# EAGLE board Sparki_Rev15 (EAGLE 6.4)
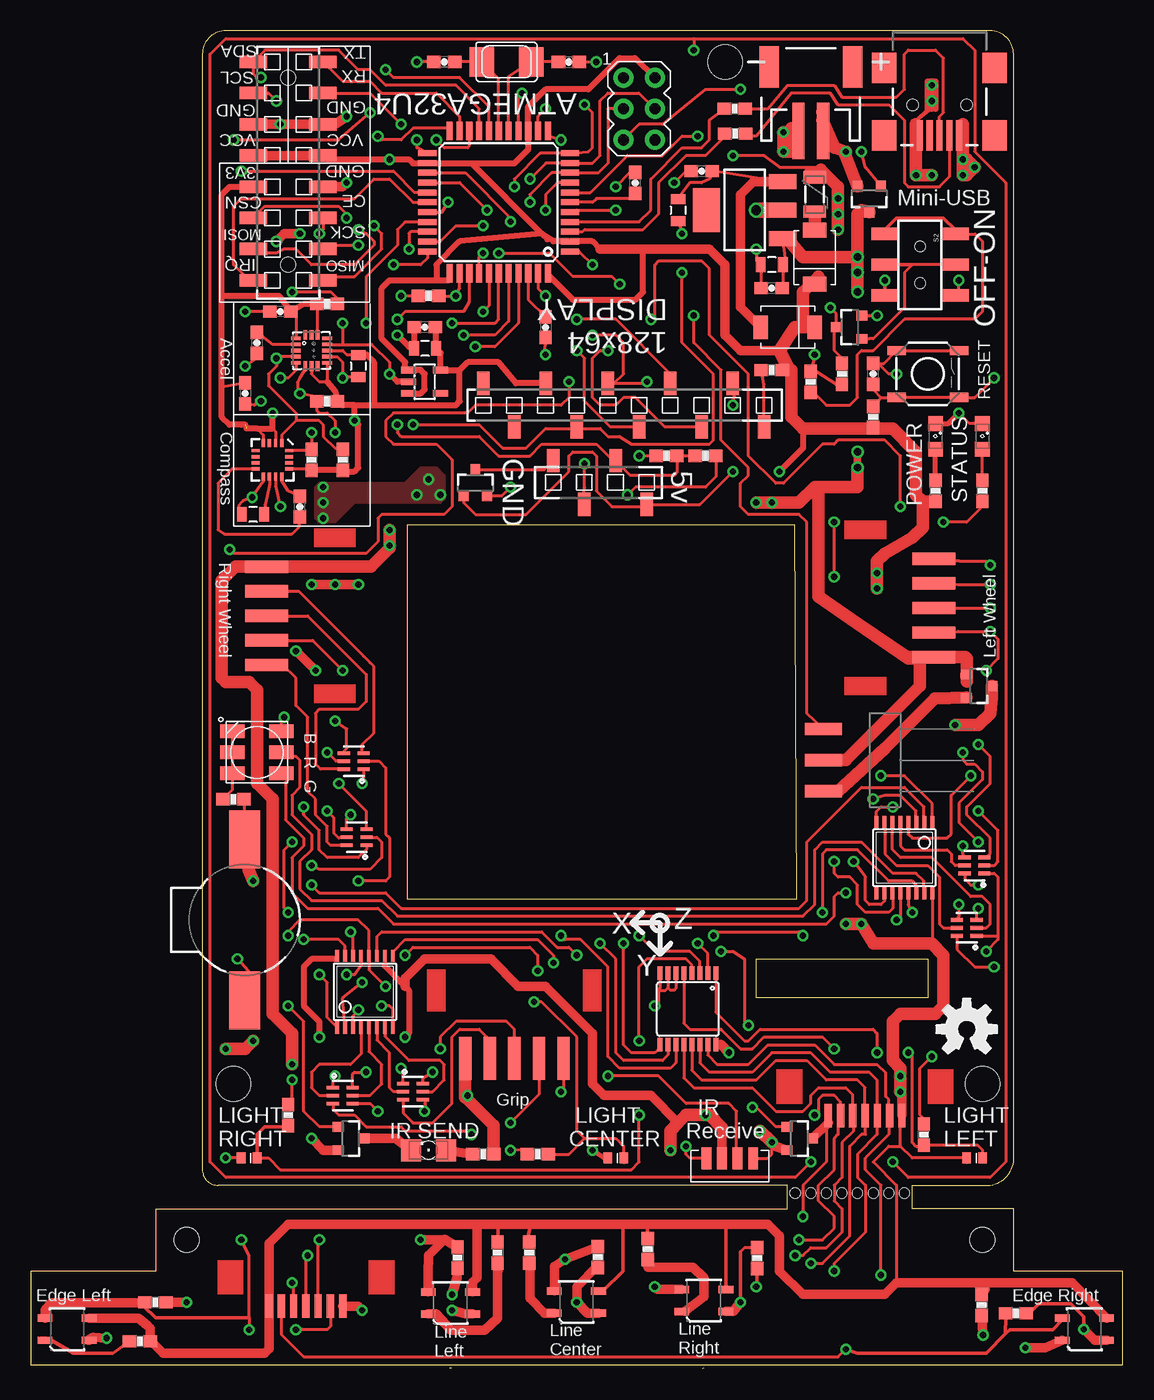
[diagram p2: board, top side]
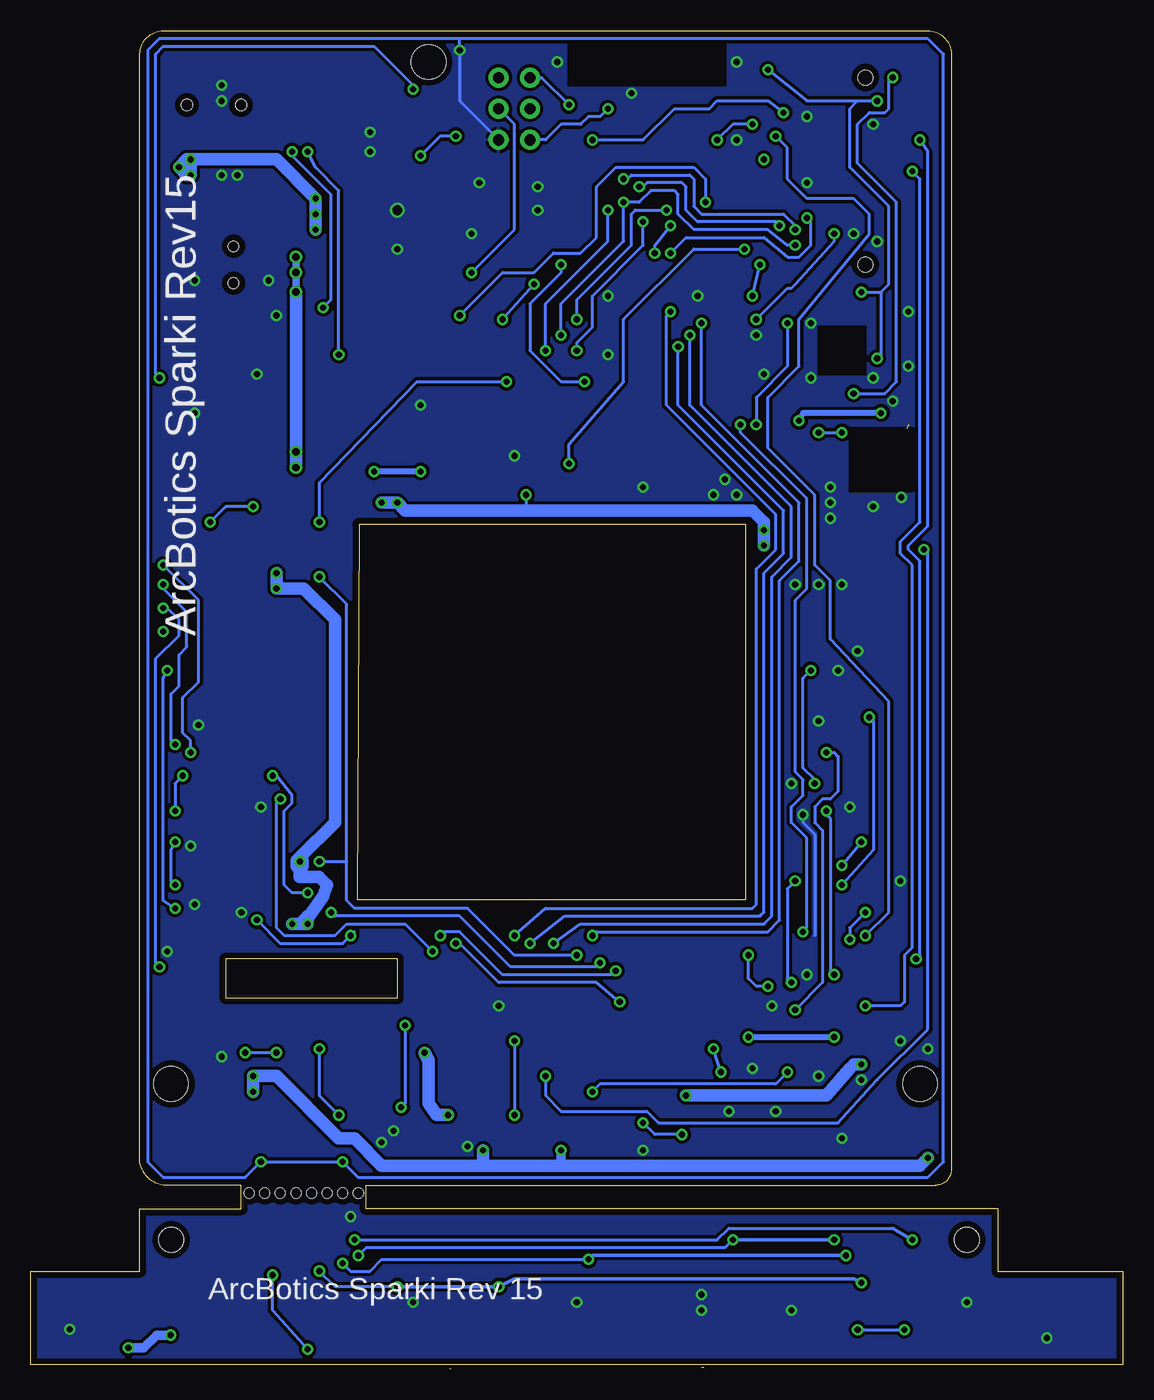
[diagram p3: board, bottom side, seen from below]

Size 88.9 x 108.92 mm. Coordinates in mm from the lower left corner, seen from the top.
Outline: 77.37,14.94 78.11,14.94 arc74 80.01,16.84 80.01,107.01 arc89 78.11,108.92 15.88,108.92 arc90 13.97,107.01 13.97,16.21 arc90 15.24,14.94 61.59,14.94 61.59,13.03 10.16,13.03 10.16,7.95 0,7.95 0,0.33 88.9,0.33 88.9,7.95 80.01,7.95 80.01,13.03 71.75,13.03 71.75,14.94 77.47,14.94
Outline: 34.11,0.1 34.24,0.08
Outline: 54.79,0.05 54.69,0
Outline: 30.66,68.74 62.18,68.74 62.31,38.21 30.66,38.21 30.66,68.74
Outline: 59.05,33.35 73.03,33.35 73.03,30.18 59.05,30.18 59.05,33.35
Copper layers (1+16): Top 0.0178mm / dielectric 59mil / Bottom 0.0178mm
Design rules "China *": minimum track width 10mil, minimum drill 14mil, track to track 10mil, track to pad 10mil, pad to pad 10mil, via to via 10mil, smd to smd 6mil, copper to edge 20mil, drill to drill 16mil, minimum pad ring 8mil, minimum via ring 8mil, stop-mask expansion 3mil, vias tented up to drill 25mil, thermal gap 10mil
Holes 2.79 mm at 56.52,106.38 16.51,23.19 77.47,23.19
Holes 2 mm at 12.7,10.49 77.47,10.49
Holes 0.8 mm at 62.23,14.3 71.12,14.3 69.85,14.3 68.58,14.3 67.31,14.3 66.04,14.3 64.77,14.3 63.5,14.3

## Footprints (pad centres in the part's own frame; a part is rotated, then mirrored left to right if it is on the bottom)
BUZZER-CCV = smd 4.724 x 2.5: + 6.54,0; - -6.54,0
0603-CAP = smd 1.1 x 1: 1 -0.85,0; 2 0.85,0
0805 = smd 0.8 x 1.2: 1 -0.9,0; 2 0.9,0
SOD-128 = smd 1.2 x 1.9: P$1 -2.223,0.016; P$2 2.179,0.016
PTC-1206 = smd 1 x 1.8: 1 -1.4,0; 2 1.4,0
TSSOP16 = smd 0.305 x 0.991: 1 -2.275,-2.918; 2 -1.625,-2.918; 3 -0.975,-2.918; 4 -0.325,-2.918; 5 0.325,-2.918; 6 0.975,-2.918; 7 1.625,-2.918; 8 2.275,-2.918; 9 2.275,2.918; 10 1.625,2.918; 11 0.975,2.918; 12 0.325,2.918; 13 -0.325,2.918; 14 -0.975,2.918; 15 -1.625,2.918; 16 -2.275,2.918
AVRISP = drill 0.9 pad 1.626: 1 -1.27,2.54; 2 1.27,2.54; 3 -1.27,0; 4 1.27,0; 5 -1.27,-2.54; 6 1.27,-2.54
JST-2-SMD = smd 1 x 4.6: 1 -1,-3.7; 2 1,-3.7 | smd 1.6 x 3.4: NC1 -3.4,1.5; NC2 3.4,1.5
1X10-2.54MM-SMD = smd 1.02 x 1.9: 1 0,1.778; 2 2.54,-1.778; 3 5.08,1.778; 4 7.62,-1.778; 5 10.16,1.778; 6 12.7,-1.778; 7 15.24,1.778; 8 17.78,-1.778; 9 20.32,1.778; 10 22.86,-1.778
1X04-2.54MM-SMD = smd 1.02 x 1.9: 1 7.62,-1.778; 2 5.08,1.778; 3 2.54,-1.778; 4 0,1.778
1X03_SMD_RA_MALE = smd 1 x 3: 1 -2.54,5; 2 0,5; 3 2.54,5
2X08-2.54MM-SMD = smd 1.016 x 2.223: 1 0,-1.556; 2 0,4.096; 3 2.54,-1.556; 4 2.54,4.096; 5 5.08,-1.556; 6 5.08,4.096; 7 7.62,-1.556; 8 7.62,4.096; 9 10.16,-1.556; 10 10.16,4.096; 11 12.7,-1.556; 12 12.7,4.096; 13 15.24,-1.556; 14 15.24,4.096; 15 17.78,-1.556; 16 17.78,4.096 | hole 1.2: 1.27,1.27; 16.51,1.27
1X05-2.0MM-JST-PH = smd 1 x 3.5: P$1 -4,-1.75; P$2 -2,-1.75; P$3 0,-1.75; P$4 2,-1.75; P$5 4,-1.75
SML0805 = smd 1.2 x 1.2: A 1.05,0; C -1.05,0
RGBLED5050 = smd 2 x 1.1: 1 -2,1.7; 2 -2,0; 3 -2,-1.7; 4 2,-1.7; 5 2,0; 6 2,1.7
FKIT-LED-1206 = smd 1.6 x 1.803: A -1.422,0; C 1.422,0
SOT23-3 = smd 0.8 x 0.9: 1 -0.95,-1; 2 0.95,-1; 3 0,1.1
0603-RES = smd 1.1 x 1: 1 -0.85,0; 2 0.85,0
TACTILE_SWITCH_SMD = smd 1.524 x 0.762: 1 -2.54,1.905; 2 2.54,1.905; 3 -2.54,-1.905; 4 2.54,-1.905
AYZ0202 = smd 1 x 2.286: 1 -2.5,2.825; 2 0,2.825; 3 2.5,2.825; 4 -2.5,-2.825; 5 0,-2.825; 6 2.5,-2.825 | hole 0.85: 1.5,0; -1.5,0
16LPCC = smd 0.65 x 0.28: 1 -1.37,0.75; 2 -1.37,0.25; 3 -1.37,-0.25; 4 -1.37,-0.75; 9 1.37,-0.75; 10 1.37,-0.25; 11 1.37,0.25; 12 1.37,0.75 | smd 0.28 x 0.65: 5 -0.75,-1.37; 6 -0.25,-1.37; 7 0.25,-1.37; 8 0.75,-1.37; 13 0.75,1.37; 14 0.25,1.37; 15 -0.25,1.37; 16 -0.75,1.37
TQFP44 = smd 1.5 x 0.5: 1 -5.8,4; 2 -5.8,3.2; 3 -5.8,2.4; 4 -5.8,1.6; 5 -5.8,0.8; 6 -5.8,0; 7 -5.8,-0.8; 8 -5.8,-1.6; 9 -5.8,-2.4; 10 -5.8,-3.2; 11 -5.8,-4; 23 5.8,-4; 24 5.8,-3.2; 25 5.8,-2.4; 26 5.8,-1.6; 27 5.8,-0.8; 28 5.8,0; 29 5.8,0.8; 30 5.8,1.6; 31 5.8,2.4; 32 5.8,3.2; 33 5.8,4 | smd 0.5 x 1.5: 12 -4,-5.8; 13 -3.2,-5.8; 14 -2.4,-5.8; 15 -1.6,-5.8; 16 -0.8,-5.8; 17 0,-5.8; 18 0.8,-5.8; 19 1.6,-5.8; 20 2.4,-5.8; 21 3.2,-5.8; 22 4,-5.8; 34 4,5.8; 35 3.2,5.8; 36 2.4,5.8; 37 1.6,5.8; 38 0.8,5.8; 39 0,5.8; 40 -0.8,5.8; 41 -1.6,5.8; 42 -2.4,5.8; 43 -3.2,5.8; 44 -4,5.8
SOT363 = smd 0.3 x 0.99: 1 -0.65,-0.8; 2 0,-0.8; 3 0.65,-0.8; 4 0.65,0.81; 5 0,0.81; 6 -0.65,0.81
LED-0402 = smd 0.7 x 0.9: 1 -0.65,0; 2 0.65,0
SOT223 = smd 1.219 x 2.235: 1 -2.311,-3.099; 2 0,-3.099; 3 2.311,-3.099 | smd 3.6 x 2.2: 4 0,3.099
TSSOP-16 = smd 0.4 x 1.1: 1 -2.275,-2.9; 2 -1.625,-2.9; 3 -0.975,-2.9; 4 -0.325,-2.9; 5 0.325,-2.9; 6 0.975,-2.9; 7 1.625,-2.9; 8 2.275,-2.9; 9 2.275,2.9; 10 1.625,2.9; 11 0.975,2.9; 12 0.325,2.9; 13 -0.325,2.9; 14 -0.975,2.9; 15 -1.625,2.9; 16 -2.275,2.9
QRE1113 = smd 1.2 x 0.6: 1 -1.8,-0.9; 2 1.8,-0.9; 3 1.8,0.9; 4 -1.8,0.9
QFN-16_0.5MM = smd 0.8 x 0.3: 1 -1.275,1; 2 -1.275,0.5; 3 -1.275,0; 4 -1.275,-0.5; 5 -1.275,-1; 9 1.275,-1; 10 1.275,-0.5; 11 1.275,0; 12 1.275,0.5; 13 1.275,1 | smd 0.3 x 0.8: 6 -0.5,-1.275; 7 0,-1.275; 8 0.5,-1.275; 14 0.5,1.275; 15 0,1.275; 16 -0.5,1.275
SOT23-5 = smd 0.55 x 1.2: 1 -0.95,-1.3; 2 0,-1.3; 3 0.95,-1.3; 4 0.95,1.3; 5 -0.95,1.3
1X07-1.0MM-FPC = smd 0.6 x 1.9: P$1 0,0.95; P$2 1,0.95; P$3 2,0.95; P$4 3,0.95; P$5 4,0.95; P$6 5,0.95; P$7 6,0.95
TSOP75338 = smd 0.8 x 1.8: 1 -2.54,0; 2 -1.27,0; 3 0,0; 4 1.27,0
USB-MINIB = smd 2.5 x 0.5: D+ 2.5,0; D- 2.5,0.8; GND 2.5,-1.6; ID 2.5,-0.8; VBUS 2.5,1.6 | smd 2.5 x 2: MTN1 -3,4.5; MTN2 2.5,4.5; MTN3 -3,-4.5; MTN4 2.5,-4.5 | hole 0.9: 0,2.2; 0,-2.2
NX5032 = smd 2 x 2.4: P$1 2,0; P$2 -2,0

## Placement (x,y rotation side)
B1  SMT-0927-T-2-R  [BUZZER-CCV]  17.42,36.53 270 top
C1  1uF  [0603-CAP]  49.21,96.53 90 top
C2  0.1uF  [0603-CAP]  17.46,79.39 270 top
C3  0.1uF  [0603-CAP]  54.61,97.49 180 top
C4  8pF  [0603-CAP]  33.66,106.38 180 top
C5  10uF  [0805]  52.7,94.31 270 top
C6  8pF  [0603-CAP]  43.81,106.38 0 top
C7  1uF  [0603-CAP]  21.91,70.18 90 top
C8  0.1uF  [0603-CAP]  41.91,84.79 270 top
C9  10uF  [0805]  32.1,83.05 180 top
C10  10uF  [0805]  60.32,89.87 180 top
C11  0.1uF  [0603-CAP]  32.07,84.79 180 top
C12  0.1uF  [0603-CAP]  60.32,87.96 180 top
C13  0.1uF  [0603-CAP]  18.41,83.52 270 top
C14  0.1uF  [0603-CAP]  20.32,86.06 180 top
C15  10uF  [0805]  26.67,81.61 270 top
C16  1uF  [0603-CAP]  68.58,80.98 90 top
C17  10uF  [0805]  18.1,69.55 180 top
D1  568-6853-2-ND  [SOD-128]  63.82,90.5 90 top
D2  568-6853-2-ND  [SOD-128]  61.59,84.79 180 top
F1  283-3139-1-ND  [PTC-1206]  63.82,95.58 270 top
IC1  568-10093-2-ND  [TSSOP16]  27.21,30.69 0 top
IC2  568-10093-2-ND  [TSSOP16]  71.12,41.61 180 top
ISP  AVRISP-6  [AVRISP]  49.53,102.57 0 top
JP1  455-1749-2-ND  [JST-2-SMD]  63.5,104.47 0 top
JP2  3M9388TR-ND  [1X10-2.54MM-SMD]  36.83,78.44 0 top
JP3  3M12031-ND  [1X04-2.54MM-SMD]  42.52,72.14 0 top
JP4  M20-8900305-ND  [1X03_SMD_RA_MALE]  69.53,49.54 90 top
JP5  3M9567TR-ND  [2X08-2.54MM-SMD]  19.69,106.38 270 top
JP6  455-1752-2-ND  [1X05-2.0MM-JST-PH]  20.96,61.29 270 top
JP7  455-1752-2-ND  [1X05-2.0MM-JST-PH]  39.37,27 0 top
JP8  455-1752-2-ND  [1X05-2.0MM-JST-PH]  71.75,61.93 90 top
LED1  STATUS  [SML0805]  77.47,75.9 270 top
LED2  POWER  [SML0805]  73.66,75.9 270 top
LED3  PLCC6RGBCT  [RGBLED5050]  18.41,50.18 180 top
LED4  1080-1358-2-ND  [FKIT-LED-1206]  32.38,17.79 180 top
LOGO1  OSHW-LOGOM  [OSHW-LOGO-M]  76.2,27.64 0 top
Q1  DMN3404LDICT-ND  [SOT23-3]  66.67,84.79 90 top
Q3  DMN3404LDICT-ND  [SOT23-3]  36.2,72.09 0 top
Q4  DMN3404LDICT-ND  [SOT23-3]  77.15,55.58 270 top
Q5  DMN3404LDICT-ND  [SOT23-3]  62.55,18.75 270 top
Q6  DMN3404LDICT-ND  [SOT23-3]  26.04,18.75 270 top
Q7  DMP2305UDITR-ND  [SOT23-3]  68.26,95.26 180 top
R1  22  [0603-RES]  57.31,102.57 180 top
R2  22  [0603-RES]  57.33,100.54 180 top
R3  10k  [0603-RES]  63.5,80.34 270 top
R4  10k  [0603-RES]  68.58,77.48 270 top
R5  220  [0603-RES]  73.66,71.45 90 top
R6  10k  [0603-RES]  32.38,87.33 180 top
R7  10k  [0603-RES]  66.04,80.98 270 top
R8  10k  [0603-RES]  25.4,73.99 270 top
R9  10k  [0603-RES]  22.86,73.99 270 top
R10  22  [0603-RES]  36.83,17.48 180 top
R11  47k  [0603-RES]  72.71,19.06 90 top
R12  47k  [0603-RES]  41.27,17.48 180 top
R13  47k  [0603-RES]  20.96,20.65 90 top
R14  220  [0603-RES]  77.47,71.45 90 top
R15  220  [0603-RES]  60.32,81.29 180 top
R16  220  [0603-RES]  50.22,9.74 270 top
R17  220  [0603-RES]  40.59,9.47 270 top
R18  47k  [0603-RES]  54.93,74.31 180 top
R19  10k  [0603-RES]  51.75,74.31 180 top
R20  220  [0603-RES]  38,9.45 270 top
R21  47k  [0603-RES]  59.14,9 90 top
R22  47k  [0603-RES]  46.15,9.08 270 top
R23  10k  [0603-RES]  24.13,86.69 0 top
R24  10k  [0603-RES]  24.13,78.75 180 top
R25  47k  [0603-RES]  34.75,9.06 270 top
R26  47k  [0603-RES]  80.19,4.52 0 top
R27  47k  [0603-RES]  10.16,5.41 0 top
R28  220  [0603-RES]  8.89,2.24 180 top
R29  220  [0603-RES]  77.41,5.19 270 top
R30  220  [0603-RES]  16.51,46.37 0 top
S1  CKN10361CT-ND  [TACTILE_SWITCH_SMD]  73.03,80.98 0 top
S2  401-2002-2-ND  [AYZ0202]  72.39,89.87 270 top
U1  342-1082-2-ND  [16LPCC]  19.69,73.99 270 top
U2  ATMEGA32U4RC-AURTR-ND  [TQFP44]  38.1,94.95 180 top
U$1  568-5977-2-ND  [SOT363]  26.29,49.46 90 top
U$2  568-5977-2-ND  [SOT363]  26.54,43.26 90 top
U$3  1080-1384-1-ND  [LED-0402]  76.84,17.16 0 top
U$4  1080-1384-1-ND  [LED-0402]  17.78,17.16 0 top
U$5  LM2940IMP-5.0/NOPBTR-ND  [SOT223]  58.1,94.31 90 top
U$6  568-2259-2-ND  [TSSOP-16]  53.5,29.29 180 top
U$7  568-5977-2-ND  [SOT363]  31.12,22.56 270 top
U$8  568-5977-2-ND  [SOT363]  25.4,22.24 270 top
U$9  ITR8307/L24-ND  [QRE1113]  54.79,5.56 0 top
U$10  MMA8452QR1TR-ND  [QFN-16_0.5MM]  22.86,82.88 0 top
U$11  1028-1014-2-ND  [SOT23-5]  32.07,80.34 270 top
U$12  WM3818TR-ND  [1X07-1.0MM-FPC]  70.92,21.56 180 top
U$13  1080-1384-1-ND  [LED-0402]  47.62,17.16 0 top
U$14  TSOP75338WTR  [TSOP75338]  57.54,17.14 0 top
U$15  568-5977-2-ND  [SOT363]  76.2,35.89 90 top
U$16  568-5977-2-ND  [SOT363]  76.84,40.97 90 top
U$18  ITR8307/L24/TR8  [QRE1113]  44.42,5.44 0 top
U$19  ITR8307/L24-ND  [QRE1113]  34.16,5.36 0 top
U$20  ITR8307/L24-ND  [QRE1113]  2.97,3.23 0 top
U$21  ITR8307/L24-ND  [QRE1113]  85.78,3.23 0 top
U$22  WM3818TR-ND  [1X07-1.0MM-FPC]  25.4,6.05 180 top
X1  ED90342TR-ND  [USB-MINIB]  73.98,102.88 270 top
X2  644-1037-2-ND  [NX5032]  38.73,106.38 0 top

## Tracks (layer width: path | path; a pad name or v marks a point on that pad's centre or on a via)
ACCEL_BYP
  Top 0.254: U$10.2 19.72,83.38 C13.1
D+
  Top 0.254: U2.4 44.13,93.36 49.53,93.36 50.48,94.31 50.48,96.85 53.02,99.39 54.61,99.39 55.24,100.03 55.24,101.61 56.52,102.57 R1.2
D-
  Top 0.254: R2.2 56.39,100.54 56.52,100.34 54.93,98.76 53.34,98.76 51.12,96.53 51.12,93.99 49.85,92.72 45.09,92.72 44.91,92.55 U2.3
GND  (via drill 0.5, 0.51, 0.8)
  Top 0.254: 33.02,106.38 C4.2 v31.43,106.38 | U2.15 39.7,103.53 v40.01,103.84 | C12.2 59.48,89.18 C10.2 59.11,90.13 59.11,91.08 v59.05,91.14 | C8.2 41.81,82.98 v41.91,82.56 | C14.2 v17.46,86.06 | 21.59,81.61 U$10.5 21.59,81.29 20.96,80.66 v20.32,80.66 | JP5.5 18.73,101.3 | JP5.6 v25.72,101.93 | JP5.10 23.81,96.22 | U2.35 34.92,89.12 34.92,87.96 v34.61,87.33 R6.1 | U2.43 41.3,87.94 v41.91,87.33 | U2.5 44.45,94.31 v47.62,94.31 | U2.23 31.43,99.39 v31.43,100.03 | R12.2 40.34,17.81 v39.05,17.79 | U$6.6 52.52,30.95 52.39,30.81 52.07,30.81 51.87,31.01 | U$6.7 51.87,31.01 | U$6.8 51.22,31.02 51.12,30.81 | 51.12,30.81 51.67,30.81 51.87,31.01 | 51.12,30.81 51.12,29.86 v50.8,29.54 | S1.2 S1.1 69.43,81.83 C16.2 69,81.83 | LED1.C 76.42,76.95 v75.56,77.8 | Q1.2 68.26,85.74 v68.9,85.74 | C6.2 v46.04,106.38 | 16.51,44.29 B1.- 17.36,43.13 R30.2 | v53.02,92.41 52.7,93.68 C5.2 | v57.15,78.44 57.34,79.39 JP2.9 | R13.2 20.96,21.6 21.27,21.92 v21.27,23.51 | R11.2 72.71,20.33 72.39,20.65 72.39,24.46 v73.34,25.41 | U1.9 18.92,72.21 v18.03,70.94 17.27,70.62 16.93,70.28 16.93,69.5 C17.2 17.2,69.49 17.14,69.55 | U1.11 19.94,71.84 v20.32,70.18 | U$16.4 75.87,41.94 75.87,42.54 v75.88,42.56 | U$16.1 77.62,40.34 78.42,40.34 78.74,40.02 78.74,35.26 | v77.79,33.99 78.74,34.94 78.74,35.26 | 71.44,38.68 IC2.13 71.45,38.12 71.44,37.8 v71.75,37.16 | U$8.4 27.64,21.59 v28.26,20.97 | U$7.4 32.07,21.92 32.08,21.91 32.08,21.59 v32.07,20.97 | U$8.1 24.6,23.66 v24.77,23.83 | U$7.1 30.31,24.31 v30.16,24.46 | U$1.4 25.4,50.18 25.72,50.5 25.72,52.08 v24.77,52.72 | U$1.1 27.09,48.06 v26.99,47.64 | U$2.4 25.73,44.79 v26.04,45.1 | U$2.1 27.34,42.27 26.67,41.61 24.13,41.61 23.5,42.24 23.5,43.83 22.23,45.1 v22.23,45.73
  Top 0.254: IC1.13 26.88,32.82 26.35,32.08 v25.72,32.08 | U$14.1 53.68,17.14 53.34,17.48 v53.34,18.11 | U$14.4 59.99,17.14 60.32,17.48 v60.32,18.43 | S2.3 75.56,87.33 v75.56,88.6 | U$10.10 24.95,82.38 25.4,81.93 v25.4,80.66 25.45,80.71 C15.2 | v75.56,37.8 75.56,36.84 75.58,36.86 U$15.4 | U$15.1 78.72,35.24 78.74,35.26 | R19.2 v49.53,74.31 | U$10.12 27.76,83.38 29.21,81.93 v29.21,80.98 | v25.4,85.1 25.4,83.52 | v17.46,81.61 18.41,82.25 C13.2 | v70.48,80.98 69.85,80.98 69,81.83 | 69,81.83 68.9,81.93 | C1.2 48.79,97.38 v47.62,96.22 | X1.GND 72.09,99.4 72.07,101.3 72.07,101.61 73.03,102.57 73.34,102.88 | v52.39,96.53 53.34,97.49 C3.2 | IC2.8 68.84,45.36 69.22,45.73 v70.17,45.73 | IC1.8 29.48,29.27 29.21,29.54 v28.58,29.54 | Q3.2 38.37,71.09 v39.05,71.77 | v18.73,78.75 18.2,78.44 C2.2 | 71.75,101.61 71.75,101.3 73.34,102.57
  Top 0.279: 69.53,87.33 v69.53,88.6
  Top 0.406: LED2.C 74.71,76.95 v75.56,77.8
  Top 0.508: U$11.2 29.84,80.34 v29.21,80.98 | 31.22,83.1 C11.2 31.12,84.79 | C9.2 31.22,83.07 31.22,83.1 | 33.34,87.22 R6.1 | v29.84,84.15 30.8,83.2 31.12,83.2 31.22,83.1 | 73.03,102.57 v73.34,104.47 | 73.03,102.57 73.03,104.79 73.66,104.79 73.66,102.57 73.03,102.57 | 73.34,102.57 v73.34,103.2 73.34,104.79
  Top 0.762: JP1.1 62.18,99.03 | Q6.2 23.81,17.8 v22.86,18.75 | Q5.2 60.64,18.11 v60.32,18.43 | 23.5,101.3 v20.32,101.3 18.73,101.3 | v25.72,101.93 24.77,101.3 | v25.72,96.53 25.4,96.22 23.81,96.22 | v20,91.77 20.64,92.41 v21.91,92.41 | v23.18,56.85 v21.59,58.43 | v22.86,63.83 v24.77,63.83 v26.67,63.83
  Top 1.016: 72.07,101.3 v72.07,97.17 v73.34,97.17 | B1.- 17.73,40.61 v18.1,39.7 | v15.88,26.05 17.46,26.05 v18.1,26.68 | 61.91,100.98 62.18,99.03 v61.28,99.07 v61.28,100.66 | v60.32,18.43 v59.37,19.38 | v75.25,52.4 77.15,52.4 78.11,53.35 78.25,54.62 Q4.3
  Top 1.27: U$5.2 v59.05,94.31
  Bottom 0.254: v26.04,45.1 26.04,44.46 25.08,43.51 25.08,35.26 | v53.98,107.33 53.98,103.2 ISP.6
  other vias: 23.81,71.77 23.81,70.5 23.81,69.23 32.38,72.4 31.43,71.13 33.34,71.13
  pour Bottom (rank 2): 13.97,109.55 80.01,109.55 80.01,13.67 13.34,13.67
  pour Top: 23.5,72.09 30.48,72.09 31.75,73.36 33.02,73.36 33.66,72.72 33.66,70.82 33.34,70.5 26.35,70.5 24.77,68.91 23.5,68.91 23.18,69.23 23.18,71.77
IR_EDGE_LEFT  (via drill 0.5)
  Top 0.254: U$6.5 53.17,28.12 53.66,27.64 56.2,27.64 57.78,26.05 58.74,26.05 59.69,27 64.45,27 v65.41,26.05 | v63.82,20.65 64.14,20.97 64.14,21.92 64.45,22.24 65.41,22.24 65.92,21.73 U$12.P$6 65.92,20.21 65.72,20.02 65.72,19.06 65.41,18.75 65.41,16.21 64.14,14.94 64.14,13.67 65.41,12.4 65.41,11.44 64.45,10.49 v62.55,10.49 | v17.14,10.49 17.78,9.22 17.78,4.14 v17.78,3.19 | U$22.P$2 24.4,3.46 24.13,3.19 v21.59,3.19
  Top 0.305: 9.26,5.36 R27.1 9.21,5.31 9.21,5.09 10.16,4.14 17.78,4.14
  Top 0.762: U$20.4 1.17,4.8 1.7,5.36 9.26,5.36
  Bottom 0.254: v65.41,26.05 65.41,22.24 v63.82,20.65 | v62.55,10.49 33.02,10.49 32.07,11.44 18.73,11.44 v17.14,10.49 | v21.59,3.19 v17.78,3.19
IR_EDGE_RIGHT  (via drill 0.5)
  Top 0.254: U$6.15 55.12,25.54 55.88,24.78 58.42,24.78 60.01,26.37 63.82,26.37 65.41,24.78 68.9,24.78 69.6,24.08 69.6,22.17 69.85,21.92 U$12.P$2 69.88,20.65 69.85,20.65 69.85,19.06 67.95,17.16 67.95,16.21 69.22,14.94 v69.22,7.63 | U$22.P$6 20.4,2.79 22.23,0.97 65.72,0.97 v66.36,1.6
  Top 0.305: R26.1 79.38,3.82 79.34,3.23 79.34,2.83 | 79.34,2.83 77.79,1.28 67.31,1.28 v66.36,1.6 | U$21.4 83.98,3.98 83.19,3.19 79.69,3.19 79.34,2.83
  Bottom 0.254: v66.36,1.6 69.22,4.78 v69.22,7.63
IR_LINE_CENTER  (via drill 0.5)
  Top 0.254: U$6.13 53.82,24.3 54.61,23.51 59.05,23.51 60.64,25.1 63.18,25.1 64.77,23.51 67.31,23.51 67.92,22.9 U$12.P$4 67.92,20.62 67.95,20.65 67.95,19.06 67.63,19.06 66.67,18.11 66.67,10.81 64.45,8.59 v63.5,8.59 | U$22.P$4 22.4,8.76 v22.54,9.22
  Top 0.762: U$18.4 42.62,8.35 v43.5,8.9 R22.1
  Bottom 0.254: v63.5,8.59 62.87,7.95 61.28,7.95 60.32,8.9 v43.5,8.9
  Bottom 0.305: v22.54,9.22 43.18,9.22 v43.5,8.9
IR_LINE_LEFT  (via drill 0.5)
  Top 0.254: U$6.12 53.17,23.68 53.98,22.87 58.74,22.87 60.64,20.97 62.87,20.97 63.5,21.6 63.5,22.24 64.14,22.87 66.36,22.87 66.92,22.31 U$12.P$5 66.95,20.65 66.99,20.65 66.99,19.38 66.04,18.43 66.04,15.57 65.41,14.94 65.41,13.67 66.04,13.03 66.04,11.13 64.77,9.86 63.5,9.86 62.87,9.22 v62.23,9.22 | U$22.P$3 23.4,9.95 v23.5,10.49
  Top 0.305: 33.66,10.49 33.7,10.54
  Top 0.762: U$19.4 32.36,7.74 32.38,9.22 33.66,10.49 v31.75,10.49 | 33.7,10.54 R25.1
  Bottom 0.254: v31.75,10.49 32.38,9.86 61.59,9.86 v62.23,9.22
  Bottom 0.305: v23.5,10.49 v31.75,10.49
IR_LINE_RIGHT  (via drill 0.5)
  Top 0.254: U$6.14 54.47,24.92 55.24,24.14 58.74,24.14 60.32,25.73 63.5,25.73 65.09,24.14 68.26,24.14 68.92,23.49 U$12.P$3 68.92,20.35 68.9,20.33 68.9,19.06 67.31,17.48 67.31,15.57 67.95,14.94 67.95,11.13 65.41,8.59 v65.41,7.95 | U$22.P$5 21.4,6.81 v21.27,7
  Top 0.305: R21.1 59.14,8.04 v59.05,6.68
  Top 0.762: U$9.4 51.02,6.46 v50.8,6.68
  Bottom 0.254: v59.05,6.68 64.14,6.68 v65.41,7.95
  Bottom 0.305: v21.27,7 21.91,7.32 49.53,7.32 v50.8,6.68 v59.05,6.68
IR_SWITCH  (via drill 0.5)
  Top 0.254: IC2.3 72.07,44.55 72.07,45.42 70.8,46.69 69.53,46.69 v68.58,46.37 | v56.2,33.99 57.15,33.99 58.1,33.35 58.1,28.27 v58.42,27.95 | v58.74,21.29 59.05,21.29 60.64,19.7 60.96,19.7 Q5.1
  Bottom 0.254: v68.58,46.37 68.9,46.05 68.9,35.89 68.26,35.26 64.14,35.26 63.18,36.21 58.42,36.21 v56.2,33.99 | v58.42,27.95 58.42,21.6 v58.74,21.29
IRSEND
  Top 0.762: R10.2 LED4.A
LED-A
  Top 0.254: JP2.10 59.69,80.13 R15.2
  Top 0.406: 59.69,75.9 JP2.10
LIGHT_CENTER  (via drill 0.5)
  Top 0.254: R12.1 43.81,17.48 45.09,18.75 | 45.09,18.75 47.62,18.75 48.26,18.11 48.26,16.86 U$13.2 | 45.09,18.75 44.45,19.38 44.45,27 41.59,29.86 v40.96,29.86 | U$6.2 55.12,33.79 v54.29,34.62
  Top 0.406: U$13.2 48.27,16.86
  Bottom 0.254: v40.96,29.86 42.86,31.45 50.8,31.45 53.98,34.62 v54.29,34.62
LIGHT_LEFT  (via drill 0.5)
  Top 0.254: 77.47,16.84 U$3.2 77.48,17.79 77.06,18.21 R11.1 72.61,18.11 72.07,18.11 71.75,18.43 71.75,25.41 v71.44,25.73 | U$6.1 55.77,29.01 58.1,26.68 58.42,26.68 59.37,27.64 68.58,27.64 68.9,27.32 v68.9,25.73
  Bottom 0.254: v68.9,25.73 v71.44,25.73
LIGHT_RIGHT  (via drill 0.5)
  Top 0.254: U$6.4 53.82,32.87 53.34,33.35 50.16,33.35 49.53,32.72 v49.53,26.68 | 18.41,16.84 U$4.2 19.37,17.16 20.32,16.21 48.89,16.21 49.53,16.84 v49.53,20.65
  Top 0.305: U$4.2 18.43,19.08 19.05,19.7 20.85,19.7 R13.1
  Bottom 0.254: v49.53,26.68 v49.53,20.65
LINEFLEDLEFT
  Top 0.305: U$9.1 53.25,4.66
  Top 0.762: 53.25,4.66 54.79,5.88 54.79,7.42 53.92,8.28 50.23,8.28 R16.2
LINEFLEDMID
  Top 0.762: U$18.1 41.83,4.54 40.64,5.73 40.64,7.94 R17.2
LINEFLEDRIGHT
  Top 0.305: 38,8.2 38.02,8.23 | 38.02,7.94 R20.2
  Top 0.762: U$19.1 33.01,4.46 34.23,3.14 36.96,3.14 38,4.1 38,8.2 | 38.02,8.23 38.02,7.94
MISO  (via drill 0.5)
  Top 0.254: v45.09,102.88 45.72,102.25 45.72,99.39 45.4,99.07 U2.11 41.47,98.95 39.37,96.85 v39.37,96.22 | JP5.16 24.77,88.6 24.77,88.91 26.35,88.91 28.58,91.14 28.58,92.41 v27.94,93.04
  Bottom 0.254: ISP.1 47.31,105.11 v45.09,102.88 | v27.94,93.04 28.26,93.36 34.61,93.36 35.56,94.31 35.56,96.22 35.88,96.53 38.73,96.53 39.05,96.22 v39.37,96.22
MOSI  (via drill 0.5)
  Top 0.254: v40.64,96.85 41.94,98.15 U2.10 45.74,98.15 46.35,98.76 46.35,103.2 46.99,103.84 49.5,103.84 ISP.4 | JP5.13 18.13,91.48 | JP5.13 18.41,91.14 | IC1.14 26.23,35.06 v26.04,35.57 | v31.12,76.85 36.51,76.85 38.42,74.94 40.32,74.94 41.91,76.53 44.32,76.53 | 44.32,76.53 JP2.4 | 44.32,76.53 46.35,76.53 46.99,75.9 47.94,75.9 48.89,75.26 55.24,75.26 55.56,75.58 55.56,80.98 53.02,83.52 v53.02,89.23 | v26.67,92.72 27.3,92.41 27.94,91.77 27.94,91.45 26.35,89.87 22.86,89.87 21.59,91.14 20.64,91.14 20,90.82 18.41,90.82 JP5.13
  Bottom 0.254: v40.64,96.85 40.32,96.85 40.01,97.17 35.24,97.17 34.92,96.85 34.92,94.63 34.29,93.99 27.62,93.99 26.67,93.04 v26.67,92.72 | v26.04,35.57 25.72,35.89 25.72,43.19 26.99,44.46 26.99,45.73 26.04,46.69 26.04,47.96 26.67,48.59 26.67,62.56 25.72,63.51 25.72,70.82 31.12,76.21 v31.12,76.85 | v53.02,89.23 49.53,92.72 49.53,101.3 ISP.4
N$2
  Top 0.406: R5.2 LED2.A
N$3
  Top 0.254: U$7.3 30.31,20.82 31.12,20.02 32.7,20.02 34.29,21.6 34.29,27 34.92,27.64 36.51,27.64 37.37,26.78 JP7.P$2
N$4
  Top 0.254: R2.1 58.38,100.34 59.05,100.34 61.91,103.84 65.09,103.84 65.72,102.88 69.85,102.88 71.12,101.61 71.12,96.53 71.44,96.22 73.98,96.22 74.78,97.02 X1.D-
N$5
  Top 0.254: R1.1 60.01,102.57 61.59,104.47 65.41,104.47 66.04,103.52 70.48,103.52 71.12,104.15 71.12,107.01 71.44,107.33 73.66,107.33 74.3,106.69 74.3,102.25 73.98,101.93 X1.D+
N$6  (via drill 0.5)
  Top 0.254: R7.1 66.04,82.25 65.41,82.88 65.41,84.62 Q1.3 65.58,85.89 v65.09,86.37 | Q7.1 67.94,97.81 v67.63,99.07
  Bottom 0.254: v65.09,86.37 64.45,87.01 64.45,95.58 67.63,98.76 v67.63,99.07
N$7
  Top 0.254: U$2.6 24.39,42.61 24.13,42.88 24.13,44.15 23.18,45.1 23.18,46.37 22.54,47 22.54,53.04 21.59,53.99 21.59,56.21 20.51,57.29 JP6.P$5
N$8
  Top 0.254: S2.2 71.75,89.87 71.12,89.23 71.12,86.37 68.58,83.83 68.27,83.84 Q1.1
  Top 0.279: 71.75,89.87 69.53,89.87
N$9
  Top 0.254: U$5.3 55.89,97.49 C3.1 55.24,96.85 54.61,96.53 53.66,96.53 52.7,95.26 C5.1
  Top 0.762: U$5.3 58.83,96.62 57.78,95.58 57.78,86.4 D2.P$2
N$10  (via drill 0.5)
  Top 0.254: U$2.3 27.34,45.39 v25.08,47.64 | JP6.P$4 22.95,59.29 v25.4,56.85
  Bottom 0.254: v25.08,47.64 25.08,47.96 26.04,48.91 26.04,56.21 v25.4,56.85
N$11  (via drill 0.5)
  Top 0.254: 53.98,108.28 15.88,108.28 14.61,107.01 14.61,16.84 15.88,15.57 62.23,15.57 v63.5,16.84 | 53.98,108.28 75.88,108.28 76.84,107.33 76.84,99.07 79.38,96.53 79.38,16.84 78.11,15.57 71.44,15.57 v70.17,16.84 | 53.98,108.28 53.98,107.33
  Bottom 0.254: 53.98,108.28 15.88,108.28 14.61,107.01 14.61,16.84 15.88,15.57 62.23,15.57 v63.5,16.84 v70.17,16.84 71.44,15.57 78.11,15.57 79.38,16.84 79.38,107.33 78.42,108.28 53.98,108.28 | 53.98,107.33 53.98,108.28
N$12
  Top 0.254: U$1.6 23.59,48.81 23.18,49.23 23.18,53.35 23.5,53.67 26.67,53.67 27.3,54.31 27.3,56.53 22.54,61.29 JP6.P$3
N$13  (via drill 0.5)
  Top 0.254: IC2.12 70.8,38.68 70.8,36.84 v70.48,36.53 | v28.89,31.13 27.53,32.49 IC1.12 27.53,35.66 26.67,36.53 21.91,36.53 20.96,35.57 v20.96,35.26 | v30.48,33.67 31.12,34.3 40.64,34.3 41.27,33.67 v41.27,32.4 | U2.22 33.97,100.66 33.97,100.98 31.12,100.98 30.16,100.03 28.58,100.03 v28.26,100.34 | v55.56,35.26 55.88,35.57 62.55,35.57 v62.87,35.26
  Bottom 0.254: v41.27,32.4 41.59,32.08 50.48,32.08 53.98,35.57 55.24,35.57 v55.56,35.26 | v20.96,35.26 19.05,37.16 19.05,54.31 23.81,59.39 23.81,64.15 25.08,65.42 25.08,71.13 28.89,74.94 28.89,79.07 26.35,81.61 26.35,85.42 20.64,92.41 20.64,93.99 21.91,95.26 25.72,95.26 27.3,96.85 27.3,99.39 v28.26,100.34 | v28.89,31.13 29.84,31.13 30.48,31.76 v30.48,33.67 | v70.48,36.53 68.58,34.62 63.5,34.62 v62.87,35.26 62.55,35.57
N$14  (via drill 0.5)
  Top 0.254: JP8.P$4 75.5,63.83 v78.11,63.83 | U$16.3 77.8,41.62 78.11,41.92 78.11,43.19 76.2,45.1 76.2,45.73 78.11,47.64 78.11,49.86 v77.15,50.81
  Bottom 0.254: v77.15,50.81 77.47,51.13 77.47,54.94 76.84,55.58 76.84,58.12 76.2,58.75 76.2,61.61 78.11,63.51 v78.11,63.83
N$15  (via drill 0.5)
  Top 0.254: U$15.6 75.41,35.26 75.41,34.15 76.84,32.72 v78.42,32.72 | JP8.P$3 v78.11,61.93
  Bottom 0.254: v78.42,32.72 78.74,33.03 78.74,57.8 76.84,59.7 76.84,60.97 77.79,61.93 v78.11,61.93
N$16  (via drill 0.5)
  Top 0.254: JP8.P$2 75.5,60.02 v78.11,60.02 78.74,59.39 78.74,57.8 v77.79,56.85 | U$15.3 77,37.33 v77.15,37.48
  Bottom 0.254: v77.15,37.48 78.11,38.11 78.11,56.21 v77.79,56.85
N$17  (via drill 0.5)
  Top 0.254: IC2.14 72.07,38.71 72.07,39.38 71.75,39.7 69.85,39.7 67.31,42.24 64.77,42.24 64.45,41.92 v64.45,37.16 | IC1.9 29.48,33.39 29.53,33.99 30.48,34.94 41.27,34.94 42.55,33.67 v42.55,33.03
  Bottom 0.254: v42.55,33.03 42.86,32.72 49.85,32.72 53.98,36.84 64.14,36.84 v64.45,37.16
N$18
  Top 0.762: Q6.3 29.69,18.75 LED4.C
N$19
  Top 0.254: R14.2 LED1.A
N$20
  Top 0.254: 18.3,73.23 U1.8 16.39,73.24 15.24,72.09 15.24,68.28 15.75,67.96 21.27,67.96 21.8,68.49 C7.1
N$21
  Top 0.254: JP6.P$2 21.81,63.29 27.09,58.01 27.62,57.48 27.94,57.16 27.94,51.77 26.99,50.81 26.99,50.11 U$1.3
N$23
  Top 0.254: Q3.3 41.79,73.19 JP3.4
N$24
  Top 0.254: R3.2 63.5,79.71 64.77,78.44 66.67,78.44 67.31,79.07 67.31,82.56 67.63,82.88 68.58,82.88 71.12,85.42 76.84,85.42 77.47,86.06 77.47,91.77 76.88,92.37 S2.1 75.25,92.4 75.25,92.41
  Top 0.279: 75.25,92.41 75.25,92.72 74.3,93.68 70.48,93.68 69.22,92.41
N$25
  Top 0.254: 65.72,47 JP4.1
  Top 1.016: 65.72,47 69.53,50.5 73.61,54.58 Q4.2
N$27
  Top 0.254: U1.12 20.44,72.29 20.96,71.45 C7.2
N$28
  Top 0.254: U1.10 19.44,71.96 19.07,70.32 19.07,69.3 C17.1
N$29
  Top 0.254: U2.42 40.5,87.05 C8.1
N$30  (via drill 0.5)
  Top 0.254: U$8.6 26.21,24 26.35,24.14 v27.3,24.14 | JP7.P$5 43.37,22.75 v43.18,22.56
  Bottom 0.254: v27.3,24.14 28.26,23.19 42.55,23.19 v43.18,22.56
N$31  (via drill 0.5)
  Top 0.254: U$8.3 24.6,21.13 25.08,20.65 26.35,20.65 27.3,19.7 30.16,19.7 30.48,19.38 35.56,19.38 v35.88,19.06 | JP7.P$4 41.37,22.33 v39.05,20.02
  Bottom 0.254: v35.88,19.06 38.1,19.06 v39.05,20.02
N$32  (via drill 0.5)
  Top 0.254: U$7.6 31.92,23.68 v32.7,24.14 | JP7.P$3 39.37,27.64 38.73,28.27 34.61,28.27 33.34,27 v33.34,26.05
  Bottom 0.254: v32.7,24.14 v33.34,26.05
N$33
  cutout Bottom: 20.96,84.79 24.77,84.79 24.77,80.98 20.96,80.98
N$34
  cutout Bottom: 17.14,76.53 22.23,76.53 22.23,71.45 17.14,71.45
N$35
  cutout Bottom: 32.38,108.92 32.38,104.47 45.09,104.47 45.09,108.92
N$36
  Top 0.254: R28.2 8.04,2.26 6.67,1.28
  Top 0.305: U$20.1 1.77,2.3 3.49,1.28 6.67,1.28
N$37  (via drill 0.5)
  Top 0.254: 80.97,1.7 v80.95,1.7
  Top 0.305: 77.51,2.76 v77.52,2.74
  Top 0.762: U$21.1 82.57,1.69 80.97,1.7 | R29.2 77.51,2.76
  Bottom 0.762: v77.52,2.74 78.66,2.74 79.7,1.7 v80.95,1.7
N$38
  cutout Bottom: 30.64,68.79 62.13,68.66 62.26,38.05 30.64,38.05
N$40  (via drill 0.5)
  Top 0.254: R14.1 77.25,70.6 77.25,69.97 76.2,68.91 v74.3,68.91 | v47.94,88.28 47.31,88.91 44.13,88.91 42.23,90.82 v38.1,90.82 | v70.8,70.18 70.8,74.31 69.53,75.58 65.72,75.58 65.41,75.26 64.45,75.26 61.28,72.09 60.64,72.09 58.42,74.31 58.42,80.98 55.24,84.15 55.24,89.55 54.61,90.18 51.12,90.18 50.8,89.87 50.8,85.74 v50.48,85.42 | U2.32 33.31,91.75 34.61,93.04 v36.83,93.04
  Bottom 0.254: v70.8,70.18 73.03,70.18 v74.3,68.91 | v47.94,88.28 v50.48,85.42 | v38.1,90.82 38.1,91.45 v36.83,93.04
N$41  (via drill 0.5, 0.6)
  Top 0.254: C12.1 61.23,88.01 C10.1 61.52,89.52 U$5.1 61.75,91.77 | R18.1 55.78,72.62 54.93,71.77 49.21,71.77 v48.58,71.13 | 35.37,22.11 35.47,22.01
  Top 0.61: v67.31,73.36 v67.31,74.63
  Top 0.762: 35.37,22.11 v35.56,22.24
  Top 1.016: v67.31,90.5 62.87,90.5 61.75,91.77 | 35.47,22.01 37.68,19.8 R10.1 | 67.31,60.66 71.31,57.93 JP8.P$1 76.07,57.93 76.2,57.8 76.2,55.94 Q4.1 | v67.31,73.36 67.31,71.77 64.14,71.77 | v67.31,87.64 v67.31,89.23 v67.31,90.5 | v21.27,24.78 21.27,27.32 19.69,28.91 19.69,46.37 18.41,47.64 18.41,55.26 17.78,55.89 15.88,55.89 15.56,56.21 15.56,64.15 16.7,65.29 JP6.P$1 27.69,65.29 29.21,66.81 v29.21,67.01 v29.21,68.28 | 64.14,71.77 63.82,71.77 62.55,70.5 v60.32,70.5 v59.05,70.5 | JP7.P$1 35.37,22.11 | Q7.3 67.63,94.31 67.31,93.99 v67.31,90.5 | JP4.2 66.36,49.54 72.39,55.58 72.39,57.8 71.44,57.8 67.31,60.66 | 67.31,60.66 64.14,62.88 64.14,71.77
  Bottom 0.254: v48.58,71.13 48.58,69.86
  Bottom 0.61: v67.31,87.64 v67.31,89.23 v67.31,90.5
  Bottom 1.016: v67.31,73.36 v67.31,74.63 v67.31,87.64 | v35.56,22.24 24.13,22.24 22.23,24.46 21.91,24.78 v21.27,24.78 | v29.21,67.01 v29.21,68.28 29.21,68.91 30.16,69.86 48.58,69.86 58.42,69.86 v59.05,70.5 v60.32,70.5
N$42
  Top 0.254: LED3.4 LED3.5 LED3.6 16.41,47.12 R30.1
N$44  (via drill 0.5)
  Top 0.254: JP8.P$5 75.6,65.74 | U$16.6 76.03,39.88 76.52,39.38 v77.15,39.38 | 75.6,65.74 73.66,65.74 | v75.88,50.18 75.88,49.54 76.2,49.23 76.84,49.23 77.47,48.59 77.47,47.96 75.56,46.05 75.56,44.46 v77.15,42.88 | 75.6,65.74 77.79,65.74 v78.11,65.42
  Bottom 0.254: v77.15,39.38 77.47,39.7 77.47,42.24 v77.15,42.88 | v75.88,50.18 75.88,51.13 76.52,51.77 76.52,54.62 75.25,55.89 75.25,62.56 v78.11,65.42
PB0  (via drill 0.5)
  Top 0.254: U2.8 42.88,96.55 41.91,95.58 v41.91,94.31 | JP2.8 51.63,76.66 49.21,79.07 48.26,79.07 47.62,78.44 46.35,78.44 45.72,79.07 45.72,82.25 46.35,82.88 v46.99,82.88
  Bottom 0.254: v46.99,82.88 46.99,86.69 41.91,91.77 v41.91,94.31
PB4
  Top 0.254: JP5.15 17.78,88.6 16.51,89.87 16.51,94.63 17.14,95.26 26.35,95.26 27.94,96.85 29.21,96.85 31.12,94.95 U2.28
PB5  (via drill 0.5)
  Top 0.254: JP4.3 63.18,53.35 63.18,68.91 62.55,69.55 58.42,69.55 57.78,70.18 57.78,72.09 58.42,72.72 58.42,73.36 56.2,75.58 56.2,81.29 53.98,83.52 v53.98,85.74 | U2.29 33.49,94.15 v33.97,94.95
  Bottom 0.254: v33.97,94.95 33.97,96.85 34.92,97.8 41.27,97.8 42.86,96.22 42.86,92.09 44.13,90.82 46.35,90.82 47.94,89.23 50.48,89.23 v53.98,85.74
PB6  (via drill 0.5)
  Top 0.254: U2.30 30.47,93.35 29.84,92.72 29.84,91.45 27.3,88.91 v27.3,85.1 | v29.84,76.85 29.84,76.21 30.16,75.9 36.51,75.9 38.1,74.31 40.64,74.31 41.59,75.26 46.04,75.26 47.38,73.92 JP3.2 48.8,72.72 52.39,72.72 52.6,72.94 R19.1 R18.2
  Bottom 0.254: v27.3,85.1 27.3,81.61 29.84,79.07 v29.84,76.85
PB7  (via drill 0.5)
  Top 0.254: B1.+ 17.73,32.35 v16.83,33.35 | v16.51,100.03 25.08,100.03 v27.62,102.25 | U2.12 42.14,100.43 42.23,100.34 v43.18,100.03
  Bottom 0.254: v16.83,33.35 16.51,33.67 16.51,65.74 17.46,66.69 17.46,67.01 15.88,68.59 15.88,99.07 v16.51,100.03 | v43.18,100.03 39.05,100.03 36.51,102.57 33.66,102.57 33.02,103.2 28.89,103.2 v27.62,102.25
PC6  (via drill 0.5)
  Top 0.254: JP3.3 44.95,70.36 45.09,71.77 v45.09,73.67 | U2.31 30.94,92.55 30.8,92.41 v30.8,91.14
  Bottom 0.254: v45.09,73.67 45.09,75.26 40.64,80.34 40.64,85.42 34.92,91.14 v30.8,91.14
PD0  (via drill 0.5)
  Top 0.254: U$10.4 20.14,82.38 v20,82.25 20,81.61 19.37,80.98 19.37,80.02 21.59,77.8 21.59,77.17 | R23.2 25.08,86.69 25.08,87.01 24.45,87.64 v21.27,87.64 | U2.18 37.3,102.73 34.92,105.11 29.53,105.11 v28.89,105.74 | JP5.3 19.37,103.84 v20,103.2 | R8.1 25.4,74.94 24.77,74.94 23.81,75.9 23.81,76.85 23.5,77.17 21.59,77.17 | U1.1 20.44,76.01 21.59,77.17
  Bottom 0.254: 19.69,87.64 19.69,82.56 v20,82.25 | v28.89,105.74 25.72,103.2 21.59,103.2 | 21.59,103.2 v20,103.2 | 21.59,103.2 22.23,102.57 22.23,97.8 19.05,94.63 19.05,88.28 19.69,87.64 | v21.27,87.64 19.69,87.64
PD1  (via drill 0.5, 0.51)
  Top 0.254: U2.19 36.5,101.6 36.51,102.57 34.61,104.47 28.89,104.47 27.62,105.74 26.67,105.74 25.08,107.33 19.08,107.33 JP5.1 18.1,106.38 18.1,105.42 18.41,105.11 v18.73,105.11 | 22.76,74.74 U1.16 | 22.76,74.74 R9.1 | v22.86,76.21 22.86,75.26 22.76,75.16 22.76,74.74 | U$10.6 22.36,81.43 21.91,80.66 21.73,80.31 21.73,79.25 v21.91,79.39 22.23,79.39 23.23,79.12 R24.2 23.28,78.02 23.5,77.8 24.13,77.8 24.77,77.17 v24.77,76.21
  Bottom 0.254: v21.91,79.39 19.37,79.39 18.41,80.34 18.41,94.95 21.59,98.12 21.59,101.3 20.64,102.25 19.37,102.25 19.05,102.57 19.05,104.79 v18.73,105.11 | v24.77,76.21 v22.86,76.21
PD4  (via drill 0.5)
  Top 0.254: JP2.6 47.18,76.66 45.09,78.75 45.09,82.25 v44.45,82.88 | U2.25 35.38,97.35 39.05,93.68 v39.05,93.36
  Bottom 0.254: v44.45,82.88 44.45,83.52 43.18,84.79 43.18,87.33 39.05,91.45 v39.05,93.36
PD6  (via drill 0.5)
  Top 0.254: JP2.7 52.07,80.98 47.62,85.42 v44.45,85.42 | U2.26 34.91,96.55 v37.15,94.31
  Bottom 0.254: v44.45,85.42 44.45,87.01 40.01,91.45 40.01,93.99 39.69,94.31 v37.15,94.31
PD7  (via drill 0.5)
  Top 0.254: Q6.1 23.5,19.7 22.23,20.97 22.23,28.27 v20.96,29.54 | v17.14,97.49 29.53,97.49 31.27,95.75 U2.27
  Bottom 0.254: v20.96,29.54 18.1,29.54 17.78,29.86 17.78,33.67 17.14,34.3 17.14,65.42 18.1,66.37 18.1,67.32 16.51,68.91 16.51,96.85 v17.14,97.49
PE2  (via drill 0.5)
  Top 0.254: R6.2 v30.16,87.33 | U2.33 32.3,90.42 31.75,89.87 v29.53,89.87
  Bottom 0.254: v30.16,87.33 v29.53,89.87
PE6  (via drill 0.5)
  Top 0.254: U$14.3 57.54,17.09 57.47,17.16 57.47,20.97 56.83,21.6 53.34,21.6 51.12,23.83 v46.99,23.83 | v43.81,80.34 43.81,79.07 43.18,78.44 36.2,78.44 35.56,77.8 29.53,77.8 28.89,77.17 28.89,75.9 29.53,75.26 33.02,75.26 34.29,73.99 34.29,70.18 33.66,69.55 28.58,69.55 28.26,69.23 28.26,67.32 27.3,66.37 16.51,66.37 v16.19,66.69 | U2.1 44.64,90.95 v45.72,89.87
  Bottom 0.254: v46.99,23.83 46.99,22.24 45.72,20.97 38.73,20.97 37.78,20.02 23.18,20.02 20,23.51 15.88,27.64 15.88,66.37 v16.19,66.69 | v45.72,89.87 45.72,89.23 48.26,86.69 48.26,82.88 45.72,80.34 v43.81,80.34
PF0  (via drill 0.5)
  Top 0.254: U$6.9 51.22,26.15 50.8,25.73 48.89,25.73 48.26,26.37 v48.26,34.62 | U2.41 39.7,85.12 37.78,83.2 v36.2,83.2
  Bottom 0.254: v48.26,34.62 45.4,36.84 29.53,36.84 29.21,37.16 29.21,64.78 27.62,66.37 27.62,69.86 36.2,78.44 v36.2,83.2
PF1  (via drill 0.5)
  Top 0.254: U$6.10 51.87,25.53 51.44,25.1 48.26,25.1 47.62,25.73 47.62,33.35 v46.35,34.62 | U2.40 38.9,85.27 37.78,84.15 v35.24,84.15
  Bottom 0.254: v46.35,34.62 44.13,36.21 29.21,36.21 28.58,36.84 28.58,64.47 26.99,66.05 26.99,70.18 35.24,78.44 v35.24,84.15
PF4  (via drill 0.5)
  Top 0.254: U$6.11 52.52,24.91 52.07,24.46 47.94,24.46 46.99,25.41 46.99,32.72 44.77,34.94 43.5,34.94 v43.18,35.26 | v34.29,85.1 37.78,85.1 38.1,85.42 U2.39
  Bottom 0.254: v43.18,35.26 42.86,35.57 28.89,35.57 27.94,36.53 27.94,64.15 26.35,65.74 26.35,70.5 34.29,78.44 v34.29,85.1
PF5  (via drill 0.5)
  Top 0.254: U$6.3 54.47,33.17 53.66,33.99 50.8,33.99 v49.53,35.26 | U2.38 37.3,86.53 v36.83,86.06
  Bottom 0.254: v49.53,35.26 46.99,37.48 30.16,37.48 29.84,37.8 29.84,65.1 28.26,66.69 28.26,69.55 37.15,78.44 37.15,85.74 v36.83,86.06
PF6  (via drill 0.5)
  Top 0.254: JP5.11 18.13,93.71 19.05,94.63 25.08,94.63 25.72,93.99 v25.72,93.68 | U2.37 36.51,90.18 36.5,90.49 v36.83,90.82
  Bottom 0.254: v36.83,90.82 35.56,92.09 29.21,92.09 27.3,90.5 26.35,90.5 25.4,91.45 25.4,93.36 v25.72,93.68
PF7  (via drill 0.5)
  Top 0.254: U2.36 35.7,86.83 35.24,86.06 30.48,86.06 v29.84,85.42 | JP5.12 23.81,92.72 v23.5,92.41
  Bottom 0.254: v29.84,85.42 27.3,87.96 26.99,87.96 26.67,88.28 23.5,91.77 v23.5,92.41
RGB_B  (via drill 0.5)
  Top 0.254: IC2.2 72.71,44.56 72.71,45.73 71.12,47.32 67.63,47.32 63.18,42.88 63.18,38.11 62.55,37.48 30.16,37.48 28.89,38.75 23.5,38.75 v22.86,39.38 | LED3.3 20.41,52.5 v20.64,53.04
  Bottom 0.254: v20.64,53.04 20.32,52.72 20.32,42.24 v22.86,39.38
RGB_G  (via drill 0.5)
  Top 0.254: LED3.1 20.96,47.96 20.73,47.73 20.73,44.69 22.23,43.19 22.23,42.56 21.27,41.61 21.27,38.75 22.54,37.48 28.26,37.48 29.53,36.21 64.77,36.21 65.41,36.84 65.41,38.43 65.72,38.75 v66.36,38.75 | IC2.1 73.39,46 71.12,48.27 v69.22,48.27
  Bottom 0.254: v66.36,38.75 67.63,38.75 68.26,39.38 68.26,45.42 67.63,46.05 67.63,46.69 68.9,48.27 v69.22,48.27
RGB_R
  Top 0.254: IC2.15 72.71,38.73 72.71,39.7 72.07,40.34 70.17,40.34 67.63,42.88 64.45,42.88 63.82,42.24 63.82,37.8 62.87,36.84 29.84,36.84 28.58,38.11 22.86,38.11 21.91,39.07 21.91,41.29 22.86,42.24 22.86,43.51 21.27,45.1 21.27,46.69 21.91,47.32 21.91,49.54 21.59,49.86 LED3.2
RST  (via drill 0.5)
  Top 0.254: R4.1 69.22,79.07 | 69.22,79.07 S1.3 S1.4 76.84,79.07 v78.42,80.66 | C16.1 68.58,79.71 69.22,79.07 | U2.13 41.3,101.96 v41.91,102.57 | ISP.5 49.53,101.3 51.44,101.3 54.93,104.15 v57.78,104.15
  Bottom 0.254: v41.91,102.57 42.55,101.93 43.5,101.93 44.13,101.3 45.72,101.3 46.99,100.03 ISP.5 | v78.42,80.66 78.74,80.98 78.74,107.01 78.11,107.65 60.96,107.65 57.78,104.47 v57.78,104.15
RX  (via drill 0.5)
  Top 0.254: JP5.4 27.62,103.84 v30.16,101.3 | U2.20 35.7,99.53 35.56,99.39 33.66,99.39 v33.02,100.03
  Bottom 0.254: v30.16,101.3 31.75,101.3 v33.02,100.03
SCK  (via drill 0.5)
  Top 0.254: ISP.3 46.99,102.57 46.99,98.12 46.21,97.35 U2.9 42.41,97.35 40.64,95.58 v40.64,94.95 | JP5.14 23.81,91.14 24.13,91.45 v26.67,91.45 | v45.72,84.15 47.62,84.15 48.26,83.52 48.26,80.98 47.5,80.21 JP2.5 50.04,80.21 v50.16,80.34 | IC2.11 70.17,38.67 70.17,37.48 69.85,37.16 67.95,37.16 67.31,37.8 67.31,39.38 66.67,40.02 65.72,40.02 65.41,40.34 v65.41,41.29 | IC1.11 28.18,35.18 28.58,35.57 41.59,35.57 42.86,34.3 43.81,34.3 v44.45,33.67 | v65.41,64.47 v65.41,68.91
  Bottom 0.254: v26.67,91.45 27.3,91.45 28.89,92.72 34.92,92.72 36.2,93.99 36.2,95.58 36.51,95.9 38.42,95.9 39.37,94.95 v40.64,94.95 40.64,91.77 45.72,86.69 v45.72,84.15 | v44.45,33.67 49.53,33.67 53.34,37.48 62.55,37.48 63.18,38.11 63.18,41.29 | 63.18,41.29 63.18,62.24 v65.41,64.47 | v50.16,80.34 57.47,80.34 65.41,72.09 v65.41,68.91 | v65.41,41.29 63.18,41.29
SENSE_GND  (via drill 0.5)
  Top 0.254: R22.2 46.15,8.37 | 64.92,19.84 64.92,20.02 U$12.P$7 64.77,20.47 64.77,16.84 62.87,14.94 v62.87,12.4 | R26.2 81.28,4.52 | R21.2 58.1,9.85 57.78,9.54
  Top 0.305: 81.28,4.52 82.04,5.28 84.68,5.28 85.72,4.24 v85.72,3.23 | v57.78,5.41 57.78,9.54
  Top 0.762: R25.2 34.72,7.42 v34.29,6.05 | R27.2 v12.7,5.41 | U$20.2 4.67,2.33 5.08,2.55 v6.19,2.5 | U$21.2 86.62,2.33 v85.72,3.23 | U$9.2 57.2,4.66 v57.78,5.41 | U$18.2 45.33,4.54 v44.45,5.41 44.45,6.67 46.15,8.37 | U$19.2 35.36,4.46 v34.29,4.78 | U$22.P$1 26.67,5.1 v26.99,4.78 | Q5.3 64.92,20.02
  pour Bottom: 90.17,13.67 90.17,-0.3 -1.27,-0.3 -1.27,14.3
STEP_1_1  (via drill 0.5)
  Top 0.254: U$1.5 24.85,49.46 v24.13,50.18 | IC1.3 26.23,28.71 v26.67,29.22
  Bottom 0.254: v24.13,50.18 23.5,50.18 23.18,49.86 23.18,47 23.81,46.37 24.45,46.37 25.08,45.73 25.08,44.46 24.45,43.83 24.45,31.45 v26.67,29.22
STEP_1_2  (via drill 0.5)
  Top 0.254: U$1.2 28.34,49.46 28.89,48.91 28.89,43.51 29.21,43.19 29.21,40.02 28.89,39.7 v26.67,39.7 | IC1.2 25.4,30.18 v26.99,31.45
  Bottom 0.254: v26.67,39.7 27.3,39.07 27.3,31.76 v26.99,31.45
STEP_1_3  (via drill 0.5)
  Top 0.254: U$2.5 25.08,43.19 24.7,43.58 24.7,44.85 v24.13,45.42 | IC1.1 24.93,27.78 24.13,28.59 24.13,31.45 v23.5,32.08
  Bottom 0.254: v24.13,45.42 24.13,45.1 23.81,44.78 23.81,32.4 v23.5,32.08
STEP_1_4  (via drill 0.5)
  Top 0.254: U$2.2 28.19,43.26 28.58,42.88 28.58,41.61 27.62,40.65 23.5,40.65 v22.86,40.97 | IC1.15 25.58,34.44 25.08,34.94 v22.23,34.94 | v21.27,42.88 20.64,42.24 20.64,37.48 v20.96,37.16
  Bottom 0.254: v22.86,40.97 v21.27,42.88 | v20.96,37.16 22.23,35.89 v22.23,34.94
STEP_2_1
  Top 0.254: U$7.5 32.7,22.56 33.66,23.51 33.66,24.78 33.34,25.1 30.8,25.1 28.83,27.06 IC1.7
STEP_2_2
  Top 0.254: U$7.2 29.53,22.56 29.21,22.87 29.21,25.73 28.18,26.76 IC1.6
STEP_2_3
  Top 0.254: U$8.5 27.62,22.24 28.58,23.19 28.58,24.78 27.53,25.82 IC1.5
STEP_2_4
  Top 0.254: IC1.4 26.88,25.63 26.04,24.78 23.5,24.78 22.86,24.14 22.86,22.87 23.5,22.24 U$8.2
STEP_3_1
  Top 0.254: IC2.7 69.53,44.56 69.53,41.92 70.48,40.97 73.03,40.97 73.98,40.02 73.98,36.21 74.3,35.89 U$15.5
STEP_3_2
  Top 0.254: IC2.6 70.14,42.26 70.8,41.61 73.34,41.61 76.52,38.43 77.47,38.43 78.11,37.8 78.11,36.21 77.79,35.89 U$15.2
STEP_3_3
  Top 0.254: IC2.5 70.8,42.56 71.12,42.24 74.61,42.24 74.93,41.92 74.93,41.29 75.25,40.97 U$16.5
STEP_3_4  (via drill 0.5)
  Top 0.254: IC2.4 71.44,44.53 71.44,43.51 71.75,43.19 74.61,43.19 74.93,43.51 74.93,46.69 v76.52,48.27 | U$16.2 78.42,40.97 78.74,41.29 78.74,43.83 v77.15,45.42
  Bottom 0.254: v76.52,48.27 77.15,47.64 v77.15,45.42
TX
  Top 0.254: JP5.2 23.81,106.38 25.4,104.79 27.62,104.79 28.58,103.84 33.02,103.84 34.92,101.93 34.92,100.77 U2.21
UCAP
  Top 0.254: C1.1 48.89,95.26 46.35,95.26 46.04,95.26 45.72,94.95 U2.6
V_BATT  (via drill 0.5)
  Top 0.254: R7.2 65.62,80.13 63.92,81.19 R3.1 63.82,82.25 v63.82,82.56
  Top 0.762: 64.45,101.61 64.34,102.36 JP1.2
  Top 1.016: 64.45,101.61 65.41,99.39 v66.36,99.07 66.31,98.8 Q7.2
  Bottom 0.254: v63.82,82.56 63.82,95.9 65.72,97.8 v66.36,99.07
V_USB
  Top 0.254: 63.82,93.33 D1.P$2
  Top 1.016: F1.2 63.82,93.33
VBUS  (via drill 0.5)
  Top 0.254: 64.32,97.62 F1.1 64,97.8 60.96,97.8 59.69,98.76 v57.15,98.76 | X1.VBUS 76.19,98.11 | U2.7 45.57,95.75 48.58,98.76 51.44,98.76 53.02,100.34 v54.29,100.34 | 75.88,101.3 75.91,99.07 X1.VBUS | 75.88,99.71 75.88,100.66 75.61,100.38 X1.VBUS
  Top 0.406: 63.18,97.49 64.14,97.49 64.14,97.62 64.32,97.62
  Top 1.016: 64.32,97.62 65.72,96.22 v65.72,95.26 | v65.72,95.26 65.72,94.95 | 75.88,101.3 75.88,100.66 v75.88,98.44 | v65.72,95.26 v65.72,93.99 v65.72,92.72 | v75.88,98.44 v75.88,97.17 76.2,97.17 v76.84,97.8 76.2,98.44 v75.88,98.44
  Bottom 0.254: v54.29,100.34 55.56,100.34 v57.15,98.76
  Bottom 1.016: v75.88,97.17 v76.84,97.8 | v76.84,97.8 v75.88,98.44 | v75.88,98.44 68.9,98.44 v65.72,95.26 v65.72,92.72 | v75.88,98.44 76.2,98.44 v76.84,97.8 | v76.84,97.8 76.2,97.17 v75.88,97.17 | v75.88,97.17 v75.88,98.44 | v75.88,98.44 75.88,98.12 76.2,97.8
VCC  (via drill 0.5)
  Top 0.254: ISP.2 50.91,105.21 | 68.8,76.53 R4.2 | Q3.1 35.24,70.5 36.2,69.55 40.32,69.55 43.81,73.04 43.81,74.31 44.13,74.63 45.72,74.63 46.04,74.31 46.04,71.45 47.31,70.18 50.33,70.18 JP3.1 54.48,70.36 v57.15,73.04 | U2.44 42.1,89.04 | U$13.1 46.67,17.16 | U$6.16 56.17,26.39 | IC1.16 24.7,33.29 24.77,33.35 | 70.8,18.11 69.85,18.11 68.58,16.84 70.48,14.94 70.48,7 | U$3.1 71.75,17.16 70.8,18.11 | 70.8,18.11 v70.8,23.83 | IC1.10 28.83,32.77 | 61.59,81.61 61.59,80.76 R15.1 | IC2.10 69.5,38.08 69.22,37.8 68.26,37.8 67.95,38.11 67.95,40.02 v66.99,41.29 | IC2.16 73.39,34.99 73.03,34.62 | 62.87,76.21 62.87,76.53 | 43.81,91.77 43.88,91.77 | U$4.1 v15.88,17.16 | 42.55,91.77 42.07,91.93
  Top 0.305: R29.1 77.72,6.49 | U$18.3 46.59,6.34 48.21,7.95 48.21,11.76 | R16.1 50.22,11.71 50.16,11.76 | U$9.3 56.59,11.61 56.44,11.76 | R17.1 40.54,10.99 40.72,11.76 | R20.1 38.02,11.51 38.28,11.76 | 36.32,11.61 36.17,11.76 | R28.1 9.74,2.34
  Top 0.406: D2.P$1 62.85,84.77 | 64.14,88.9 D1.P$1 | 43.92,91.77 U2.2 43.88,91.77 | JP5.8 23.81,98.76 | 32.27,98.12 U2.24 32.38,98.12 | 34.02,88.6 U2.34 | 76.2,16.86 U$3.1 | 46.67,17.16 v45.72,17.79 | 70.92,22.44 v70.8,22.56
  Top 0.508: 41.59,92.41 34.92,91.77 33.02,89.87 33.02,88.6 | 46.35,91.14 45.72,91.77 43.92,91.77 | 23.81,98.76 24.13,98.44 v29.21,98.44 30.8,98.44 31.12,98.12 32.27,98.12 | 32.38,98.12 35.88,98.12 | 35.88,98.12 39.37,98.12 40.5,99.25 U2.14 40.5,102.74 41.91,104.15 45.4,104.15 47.94,106.69 49.19,106.69 ISP.2 | 33.02,88.6 29.21,88.6 28.58,87.96 28.58,83.83 30.48,81.93 30.48,81.29 U$11.1 31.75,81.29 32.07,80.98 32.07,79.71 31.75,79.39 U$11.3 | 33.02,88.6 34.02,88.6 | 42.1,89.04 44.13,87.01 49.21,87.01 49.85,87.64 49.85,91.14 | 24.77,33.35 22.86,33.35 22.23,32.72 22.23,29.54 23.5,28.27 v23.5,27 | 28.83,32.77 30.48,31.13 30.8,30.81 30.8,27.32 v30.48,27 | 43.81,91.77 42.55,91.77 41.59,92.41 | 41.59,92.41 42.07,91.93 | 41.59,92.41 35.88,98.12 | 62.87,76.21 62.87,74.94 v60.96,73.04
  Top 0.762: 46.35,91.14 49.85,91.14 55.24,91.14 56.52,89.87 56.52,84.15 57.78,82.88 60.96,82.88 | U$14.2 56.27,19.63 | 55.24,20.65 v54.93,20.65 | 56.17,26.39 v56.83,25.73 | 77.47,7 70.48,7 69.53,6.05 62.87,6.05 60.96,7.95 60.96,10.81 60.01,11.76 56.44,11.76 50.16,11.76 48.21,11.76 40.72,11.76 38.28,11.76 36.17,11.76 20.96,11.76 19.4,10.21 U$22.P$7 19.4,1.63 19.05,1.28 10.8,1.28 9.74,2.34 | 77.47,7 84.77,7 U$21.3 | 77.72,6.49 77.47,7 | U$19.3 35.96,7.06 36.32,7.42 36.32,11.61 | U$20.3 8.8,4.13 9.53,3.51 9.74,3.29 R28.1 | U$12.P$1 70.92,22.44 | 52.7,20.02 50.48,22.24 46.67,22.24 45.72,23.19 45.72,27.32 41.91,31.13 39.69,31.13 37.47,33.35 32.07,33.35 30.48,31.76 30.48,31.13 | JP5.8 JP5.7
  Top 1.016: 62.85,84.77 62.87,87.64 64.14,88.9 | D2.P$1 62.21,84.77 60.96,82.88 61.59,81.61 61.91,81.29 61.91,77.48 62.87,76.53 68.8,76.53 70.17,76.53 72.07,74.63 72.07,71.13 72.61,70.6 | R5.1 72.61,70.6 | 56.27,19.63 55.24,20.65 | v66.36,36.21 v67.63,36.21 68.58,34.62 73.03,34.62 73.34,34.62 74.3,33.67 74.3,29.54 73.66,28.91 70.8,28.91 70.17,28.27 70.17,25.1 70.8,24.46 v70.8,23.83 v70.8,22.56 | v52.07,17.79 52.07,19.38 52.7,20.02 53.34,20.65 v54.93,20.65 | 72.61,70.6 72.61,68.49 71.75,67.64 69.53,66.37 68.9,65.74 v68.9,63.51 v68.9,64.78
  Bottom 0.508: v30.48,27 v23.5,27 | v57.15,73.04 v60.96,73.04
  Bottom 0.762: 45.72,16.52 v45.72,17.79
  Bottom 1.016: v56.83,25.73 56.52,25.1 56.52,21.6 55.88,20.65 v54.93,20.65 | 52.07,16.52 60.32,16.52 62.55,18.75 63.82,18.75 68.9,23.83 v70.8,23.83 v70.8,22.56 | 52.07,16.52 45.72,16.52 16.51,16.52 v15.88,17.16 | 52.07,16.52 v52.07,17.79 | v68.9,64.78 v68.9,63.51 66.67,63.51 64.14,60.97 64.14,44.46 66.99,41.61 v66.99,41.29 66.99,40.02 65.41,40.02 64.77,39.38 65.09,38.43 66.67,36.21 | 66.67,36.21 66.36,36.84 | 66.36,36.84 v66.36,36.21 66.67,36.21 | 66.67,36.21 v67.63,36.21 66.99,36.21 66.36,36.84
  Bottom 1.524: 66.99,40.97 v66.99,41.29
VCC_3V3  (via drill 0.5)  (1 unrouted)
  Top 0.254: C14.1 21.17,85.88 21.45,85.88 21.59,85.74 U$10.1 | U$10.11 25.4,82.88 25.72,82.56 26.62,82.56 C15.1 26.35,82.56 | U1.13 23.4,73.24 R9.2 | U1.4 18.94,76.01 18.41,76.53 | U1.2 19.94,76.28 19.69,76.53 | U$10.9 24.13,80.34 23.5,80.34 22.86,80.98 U$10.7 | 25.08,78.75 R24.1 | U$10.14 23.36,86.61 R23.1 | 17.25,76.95 17.14,76.85 | 25.4,73.04 R8.2 | C2.1 15.56,79.92 15.56,80.02
  Top 0.508: 17.46,76.85 17.14,76.85 16.19,76.85 15.56,77.48 15.56,80.02 15.56,87.33 | C15.1 27.3,82.56 27.94,81.93 27.94,78.44 | JP2.3 39.5,80.21 38.1,81.93 35.56,81.93 34.92,81.29 | R23.1 22.23,86.69 C14.1 20.96,86.06 20.96,86.37 20.22,87.33 15.56,87.33 | R8.2 R9.2 | 17.57,76.53 18.41,76.53 19.69,76.53 v19.69,77.8 | 24.13,80.34 24.77,79.6 R24.1 | 26.35,78.44 25.4,78.44 25.08,78.75 | 25.4,73.04 26.35,73.04 26.67,73.36 26.67,76.85 v26.35,77.17 26.35,78.44 | 33,84.71 C9.1 33.37,82.68 U$11.5 34.92,81.29 | 26.35,78.44 27.94,78.44 | 27.94,78.44 34.61,78.44 34.92,78.75 34.92,81.29 | 15.56,87.33 15.56,95.58 16.19,96.22 JP5.9
  Top 0.762: 33,84.71 C11.1
  Bottom 0.508: v19.69,77.8 26.04,77.8 v26.35,77.17
XTAL1
  Top 0.254: C4.1 X2.P$2 38.1,105.01 U2.17
XTAL2
  Top 0.254: U2.16 38.9,105.18 X2.P$1 C6.1

## Text on the board
tPlace: SDA | TX | SCL | RX | GND | ATMEGA32U4 | GND | VCC | VCC | 3V3 | GND | CSN | CE | Mini-USB | MOSI | SCK | IRQ | MISO | 128x64 / DISPLAY | OFF-ON | Accel | RESET | Compass | GND | 5v | Right Wheel | Left Wheel | B | R | G | X | Z | Y | Grip | LIGHT / RIGHT | IR SEND | LIGHT / CENTER | IR / Receive | LIGHT / LEFT | Edge Left | Edge Right | Line / Center | Line / Right | Line / Left
bPlace: ArcBotics Sparki Rev15 | ArcBotics Sparki Rev 15